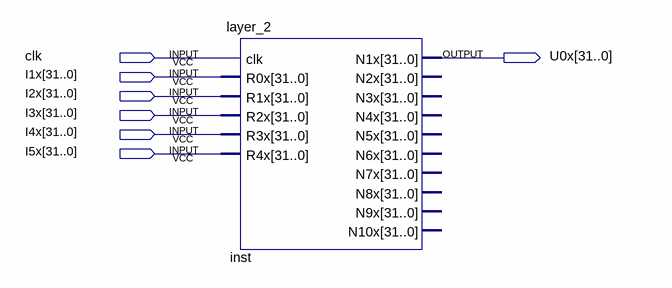
[diagram p0: schematic sheet]
// Quartus schematic wavetest.bdf as structural Verilog: 1 symbols, 7 pins
module wavetest (
  input  clk,
  input  [31:0] I1x,
  input  [31:0] I2x,
  input  [31:0] I3x,
  input  [31:0] I4x,
  input  [31:0] I5x,
  output [31:0] U0x
);

  layer_2 inst (
    .clk(clk), .R0x(I1x), .R1x(I2x), .R2x(I3x), .R3x(I4x), .R4x(I5x), .N1x(U0x));  // open: N2x, N3x, N4x, N5x, N6x, N7x, N8x, N9x, N10x
endmodule
